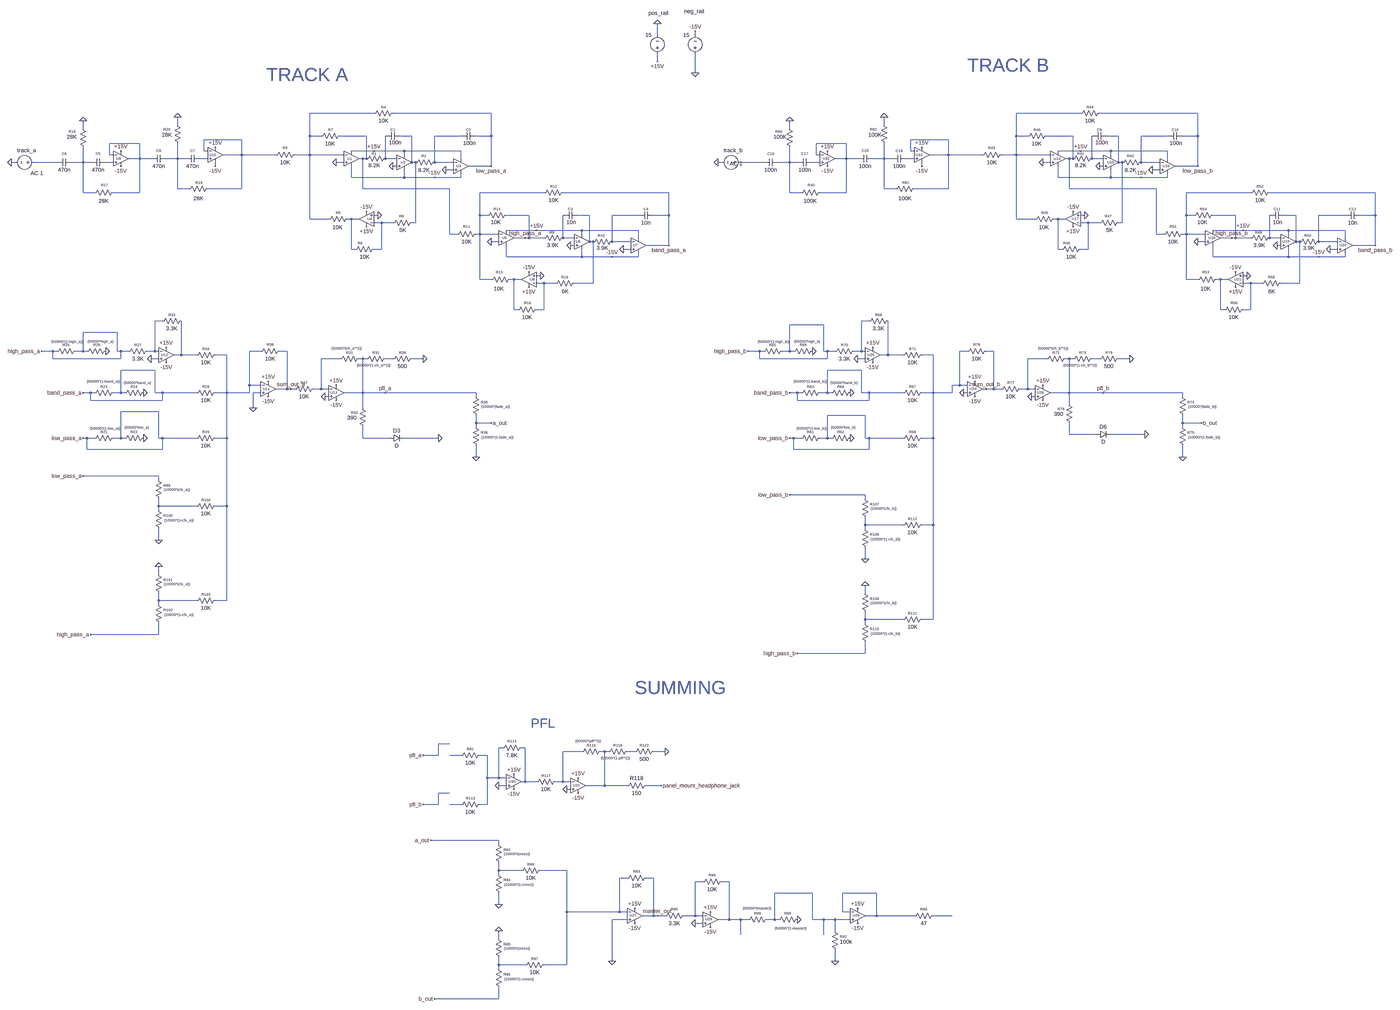
[diagram p0: schematic Full_Mixer.asc, whole sheet]
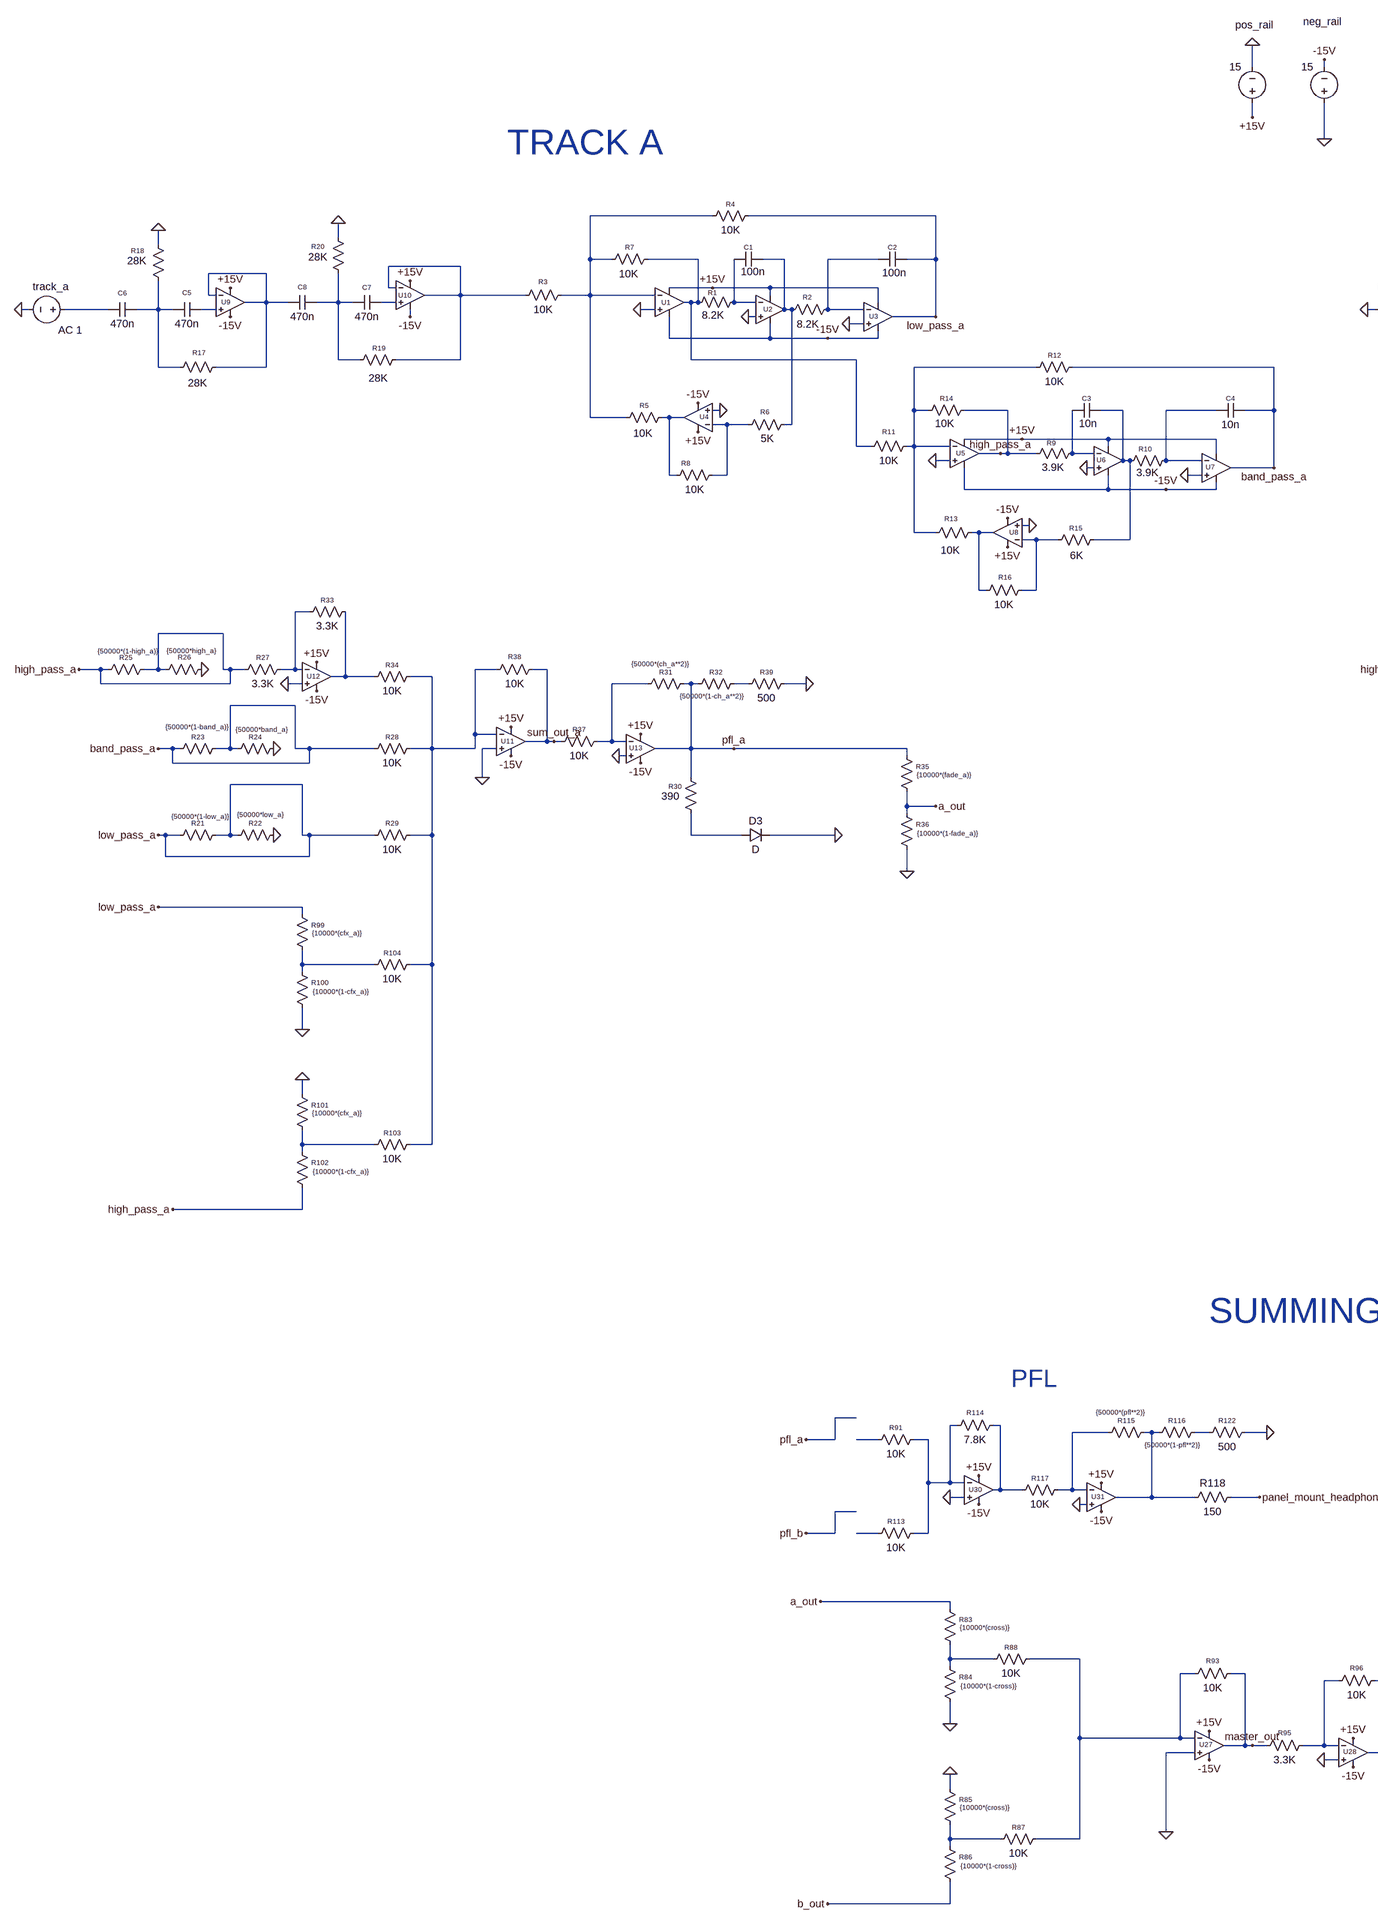
[diagram p1: schematic Full_Mixer.asc, part, row 1 of 1, column 1 of 2]
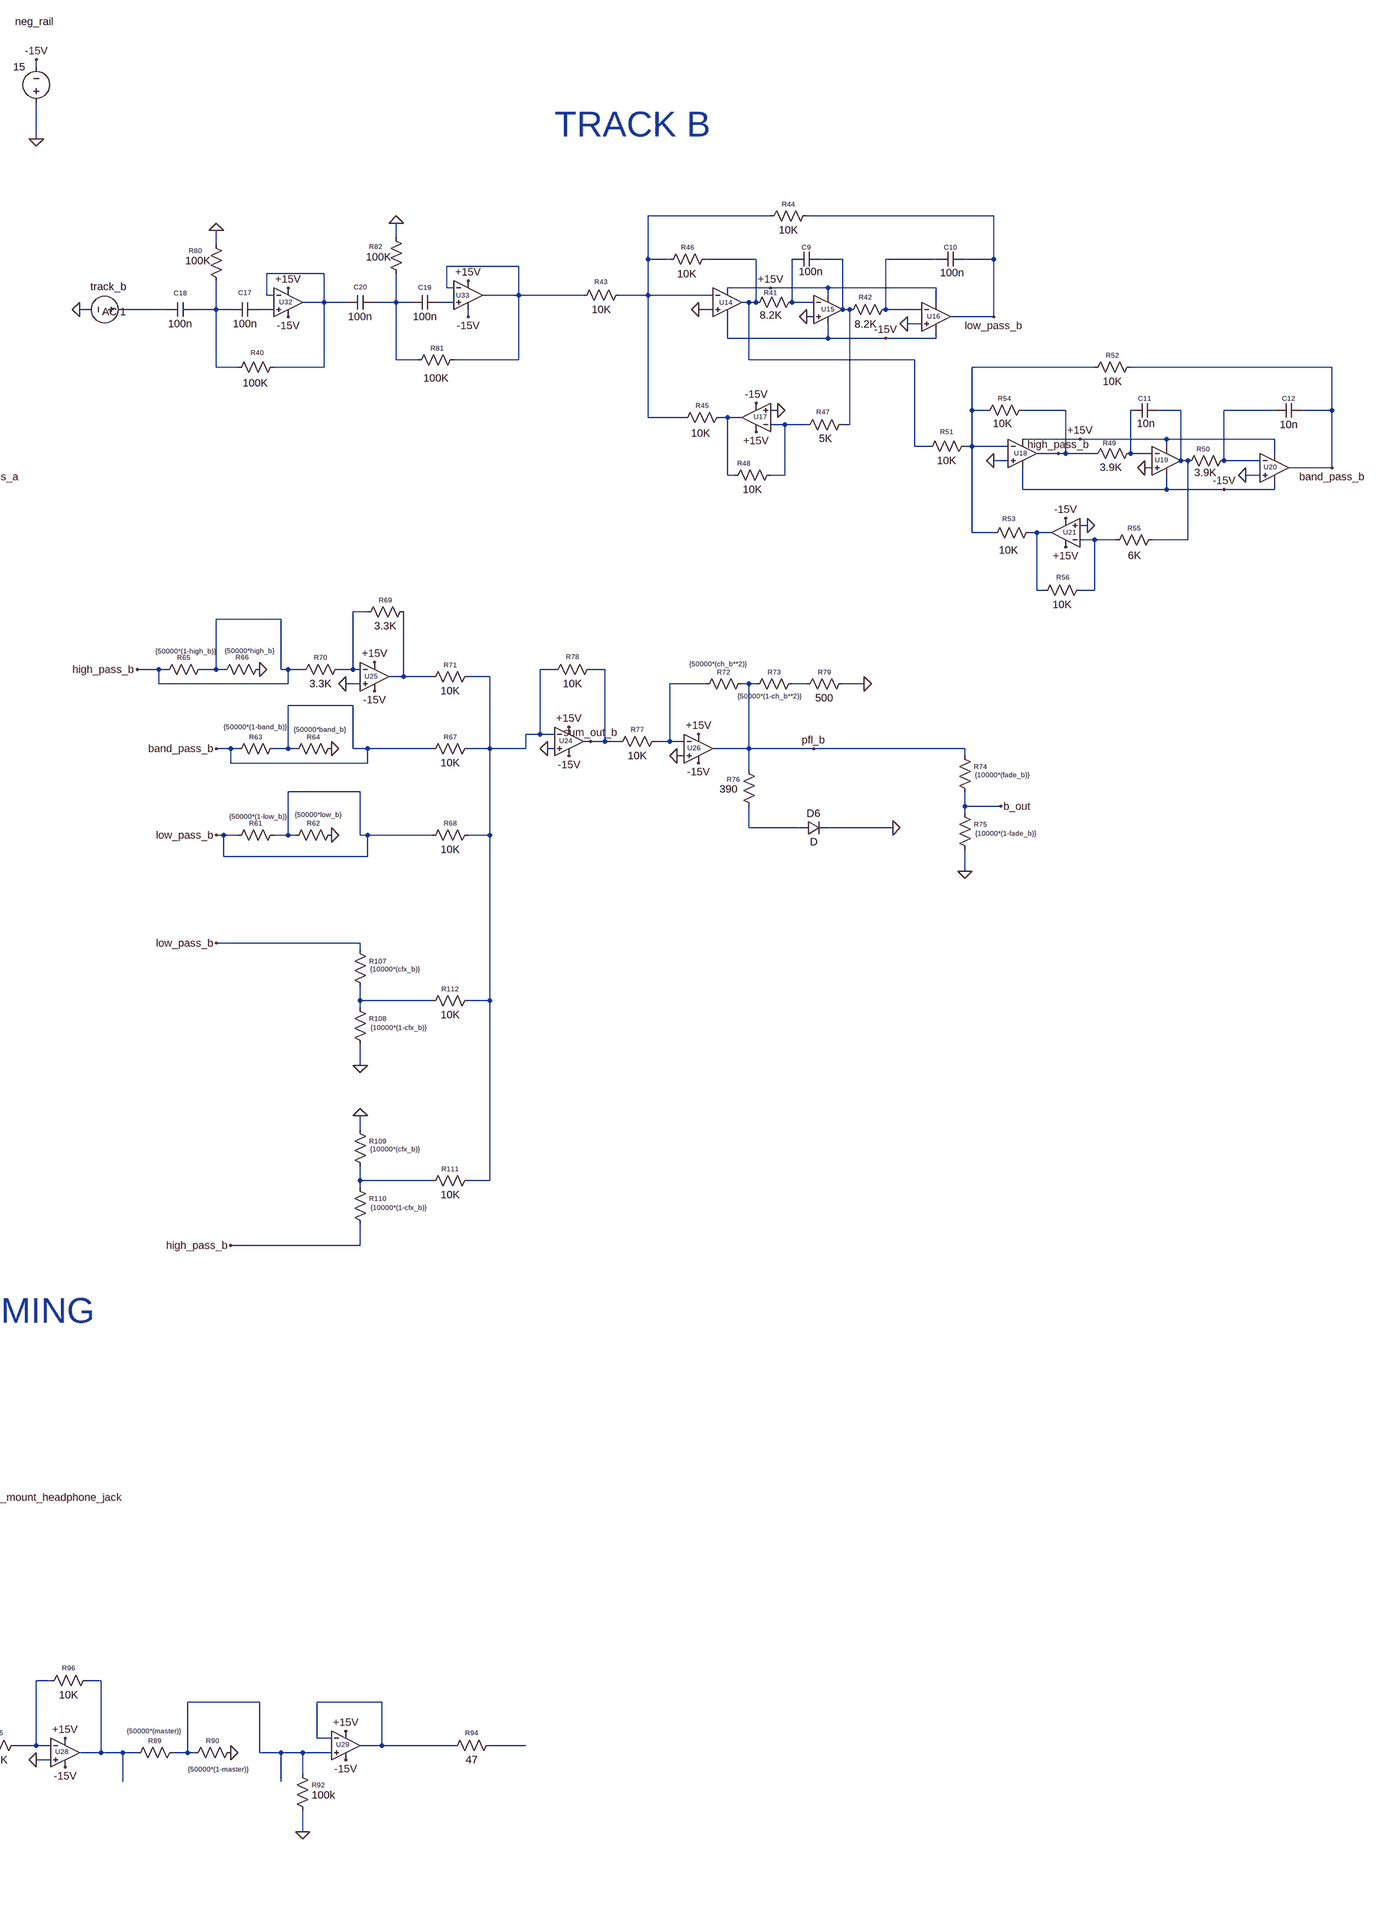
[diagram p2: schematic Full_Mixer.asc, part, row 1 of 1, column 2 of 2]
Full_Mixer.asc, the LTspice schematic file:
Version 4.1
SHEET 1 3956 3308
WIRE 400 -1248 400 -1296
WIRE 560 -1248 560 -1264
WIRE 400 -1136 400 -1168
WIRE 560 -1088 560 -1168
WIRE -800 -880 -1072 -880
WIRE -304 -880 -720 -880
WIRE 2192 -880 1920 -880
WIRE 2688 -880 2272 -880
WIRE -1632 -832 -1632 -864
WIRE 1360 -832 1360 -864
WIRE -2032 -816 -2032 -848
WIRE 960 -816 960 -848
WIRE -1072 -784 -1072 -880
WIRE -1024 -784 -1072 -784
WIRE -832 -784 -944 -784
WIRE -640 -784 -688 -784
WIRE -432 -784 -544 -784
WIRE -304 -784 -304 -880
WIRE -304 -784 -368 -784
WIRE 1920 -784 1920 -880
WIRE 1968 -784 1920 -784
WIRE 2160 -784 2048 -784
WIRE 2352 -784 2304 -784
WIRE 2560 -784 2448 -784
WIRE 2688 -784 2688 -880
WIRE 2688 -784 2624 -784
WIRE -1360 -768 -1520 -768
WIRE 1632 -768 1472 -768
WIRE -1792 -752 -1920 -752
WIRE 1200 -752 1072 -752
WIRE -1520 -720 -1520 -768
WIRE -1504 -720 -1520 -720
WIRE -800 -720 -896 -720
WIRE -672 -720 -800 -720
WIRE -432 -720 -672 -720
WIRE 1472 -720 1472 -768
WIRE 1488 -720 1472 -720
WIRE 2192 -720 2096 -720
WIRE 2320 -720 2192 -720
WIRE 2560 -720 2320 -720
WIRE -1920 -704 -1920 -752
WIRE -1904 -704 -1920 -704
WIRE -1360 -704 -1360 -768
WIRE -1360 -704 -1440 -704
WIRE -1216 -704 -1360 -704
WIRE -1072 -704 -1072 -784
WIRE -1072 -704 -1136 -704
WIRE -928 -704 -1072 -704
WIRE -672 -704 -672 -720
WIRE 1072 -704 1072 -752
WIRE 1088 -704 1072 -704
WIRE 1632 -704 1632 -768
WIRE 1632 -704 1552 -704
WIRE 1776 -704 1632 -704
WIRE 1920 -704 1920 -784
WIRE 1920 -704 1856 -704
WIRE 2064 -704 1920 -704
WIRE 2320 -704 2320 -720
WIRE -1792 -688 -1792 -752
WIRE -1792 -688 -1840 -688
WIRE -1744 -688 -1792 -688
WIRE -1632 -688 -1632 -752
WIRE -1632 -688 -1680 -688
WIRE -1600 -688 -1632 -688
WIRE -1504 -688 -1536 -688
WIRE -848 -688 -864 -688
WIRE -832 -688 -832 -784
WIRE -832 -688 -848 -688
WIRE -752 -688 -752 -784
WIRE -704 -688 -752 -688
WIRE -432 -688 -432 -720
WIRE 1200 -688 1200 -752
WIRE 1200 -688 1152 -688
WIRE 1248 -688 1200 -688
WIRE 1360 -688 1360 -752
WIRE 1360 -688 1312 -688
WIRE 1392 -688 1360 -688
WIRE 1488 -688 1456 -688
WIRE 2144 -688 2128 -688
WIRE 2160 -688 2160 -784
WIRE 2160 -688 2144 -688
WIRE 2240 -688 2240 -784
WIRE 2288 -688 2240 -688
WIRE 2560 -688 2560 -720
WIRE -2320 -672 -2336 -672
WIRE -2144 -672 -2240 -672
WIRE -2032 -672 -2032 -736
WIRE -2032 -672 -2080 -672
WIRE -2000 -672 -2032 -672
WIRE -1904 -672 -1936 -672
WIRE -928 -672 -960 -672
WIRE -640 -672 -640 -784
WIRE -624 -672 -640 -672
WIRE -544 -672 -544 -784
WIRE -464 -672 -544 -672
WIRE 672 -672 656 -672
WIRE 848 -672 752 -672
WIRE 960 -672 960 -736
WIRE 960 -672 912 -672
WIRE 992 -672 960 -672
WIRE 1088 -672 1056 -672
WIRE 2064 -672 2032 -672
WIRE 2352 -672 2352 -784
WIRE 2368 -672 2352 -672
WIRE 2448 -672 2448 -784
WIRE 2528 -672 2448 -672
WIRE -1472 -656 -1472 -672
WIRE -704 -656 -720 -656
WIRE -304 -656 -304 -784
WIRE -304 -656 -400 -656
WIRE 1520 -656 1520 -672
WIRE 2288 -656 2272 -656
WIRE 2688 -656 2688 -784
WIRE 2688 -656 2592 -656
WIRE -464 -640 -496 -640
WIRE 2528 -640 2496 -640
WIRE -896 -608 -896 -656
WIRE -672 -608 -672 -640
WIRE -672 -608 -896 -608
WIRE -544 -608 -672 -608
WIRE -432 -608 -432 -624
WIRE -432 -608 -544 -608
WIRE 2096 -608 2096 -656
WIRE 2320 -608 2320 -640
WIRE 2320 -608 2096 -608
WIRE 2448 -608 2320 -608
WIRE 2560 -608 2560 -624
WIRE 2560 -608 2448 -608
WIRE -1632 -560 -1632 -688
WIRE -1584 -560 -1632 -560
WIRE -1360 -560 -1360 -704
WIRE -1360 -560 -1504 -560
WIRE -848 -560 -848 -688
WIRE -480 -560 -848 -560
WIRE 1360 -560 1360 -688
WIRE 1408 -560 1360 -560
WIRE 1632 -560 1632 -704
WIRE 1632 -560 1488 -560
WIRE 2144 -560 2144 -688
WIRE 2512 -560 2144 -560
WIRE -2032 -544 -2032 -672
WIRE -1984 -544 -2032 -544
WIRE -1792 -544 -1792 -688
WIRE -1792 -544 -1904 -544
WIRE -80 -544 -352 -544
WIRE 448 -544 0 -544
WIRE 960 -544 960 -672
WIRE 1008 -544 960 -544
WIRE 1200 -544 1200 -688
WIRE 1200 -544 1088 -544
WIRE 2912 -544 2640 -544
WIRE 3440 -544 2992 -544
WIRE -784 -448 -800 -448
WIRE -352 -448 -352 -544
WIRE -320 -448 -352 -448
WIRE -144 -448 -240 -448
WIRE 112 -448 64 -448
WIRE 320 -448 208 -448
WIRE 448 -448 448 -544
WIRE 448 -448 384 -448
WIRE 2208 -448 2192 -448
WIRE 2640 -448 2640 -544
WIRE 2672 -448 2640 -448
WIRE 2848 -448 2752 -448
WIRE 3104 -448 3056 -448
WIRE 3312 -448 3200 -448
WIRE 3440 -448 3440 -544
WIRE 3440 -448 3376 -448
WIRE -1072 -432 -1072 -704
WIRE -992 -432 -1072 -432
WIRE -896 -432 -912 -432
WIRE -864 -432 -896 -432
WIRE 1920 -432 1920 -704
WIRE 2000 -432 1920 -432
WIRE 2096 -432 2080 -432
WIRE 2128 -432 2096 -432
WIRE -768 -416 -800 -416
WIRE -720 -416 -768 -416
WIRE -624 -416 -624 -672
WIRE -624 -416 -640 -416
WIRE 2224 -416 2192 -416
WIRE 2272 -416 2224 -416
WIRE 2368 -416 2368 -672
WIRE 2368 -416 2352 -416
WIRE -112 -384 -240 -384
WIRE 80 -384 -112 -384
WIRE 320 -384 80 -384
WIRE 2880 -384 2752 -384
WIRE 3072 -384 2880 -384
WIRE 3312 -384 3072 -384
WIRE -480 -368 -480 -560
WIRE -448 -368 -480 -368
WIRE -352 -368 -352 -448
WIRE -352 -368 -368 -368
WIRE -272 -368 -352 -368
WIRE 80 -368 80 -384
WIRE 2512 -368 2512 -560
WIRE 2544 -368 2512 -368
WIRE 2640 -368 2640 -448
WIRE 2640 -368 2624 -368
WIRE 2720 -368 2640 -368
WIRE 3072 -368 3072 -384
WIRE -160 -352 -208 -352
WIRE -144 -352 -144 -448
WIRE -144 -352 -160 -352
WIRE -80 -352 -144 -352
WIRE 0 -352 0 -448
WIRE 48 -352 0 -352
WIRE 320 -352 320 -384
WIRE 2832 -352 2784 -352
WIRE 2848 -352 2848 -448
WIRE 2848 -352 2832 -352
WIRE 2912 -352 2848 -352
WIRE 2992 -352 2992 -448
WIRE 3040 -352 2992 -352
WIRE 3312 -352 3312 -384
WIRE -272 -336 -304 -336
WIRE 112 -336 112 -448
WIRE 128 -336 112 -336
WIRE 208 -336 208 -448
WIRE 288 -336 208 -336
WIRE 2720 -336 2688 -336
WIRE 3104 -336 3104 -448
WIRE 3120 -336 3104 -336
WIRE 3200 -336 3200 -448
WIRE 3280 -336 3200 -336
WIRE 48 -320 32 -320
WIRE 448 -320 448 -448
WIRE 448 -320 352 -320
WIRE 3040 -320 3024 -320
WIRE 3440 -320 3440 -448
WIRE 3440 -320 3344 -320
WIRE -896 -304 -896 -432
WIRE -880 -304 -896 -304
WIRE -768 -304 -768 -416
WIRE -768 -304 -800 -304
WIRE 288 -304 256 -304
WIRE 2096 -304 2096 -432
WIRE 2112 -304 2096 -304
WIRE 2224 -304 2224 -416
WIRE 2224 -304 2192 -304
WIRE 3280 -304 3248 -304
WIRE -240 -272 -240 -320
WIRE 80 -272 80 -304
WIRE 80 -272 -240 -272
WIRE 208 -272 80 -272
WIRE 320 -272 320 -288
WIRE 320 -272 208 -272
WIRE 2752 -272 2752 -320
WIRE 3072 -272 3072 -304
WIRE 3072 -272 2752 -272
WIRE 3200 -272 3072 -272
WIRE 3312 -272 3312 -288
WIRE 3312 -272 3200 -272
WIRE -96 -192 -112 -192
WIRE 2896 -192 2880 -192
WIRE -352 -176 -352 -368
WIRE -304 -176 -352 -176
WIRE -208 -176 -224 -176
WIRE -176 -176 -208 -176
WIRE 2640 -176 2640 -368
WIRE 2688 -176 2640 -176
WIRE 2784 -176 2768 -176
WIRE 2816 -176 2784 -176
WIRE -80 -160 -112 -160
WIRE -32 -160 -80 -160
WIRE 128 -160 128 -336
WIRE 128 -160 48 -160
WIRE 2912 -160 2880 -160
WIRE 2960 -160 2912 -160
WIRE 3120 -160 3120 -336
WIRE 3120 -160 3040 -160
WIRE -208 -48 -208 -176
WIRE -192 -48 -208 -48
WIRE -80 -48 -80 -160
WIRE -80 -48 -112 -48
WIRE 2784 -48 2784 -176
WIRE 2800 -48 2784 -48
WIRE 2912 -48 2912 -160
WIRE 2912 -48 2880 -48
WIRE -1696 0 -1728 0
WIRE 1296 0 1264 0
WIRE 1104 16 960 16
WIRE -1888 48 -2032 48
WIRE -2160 128 -2208 128
WIRE -2144 128 -2160 128
WIRE -2032 128 -2032 48
WIRE -2032 128 -2064 128
WIRE -2016 128 -2032 128
WIRE -1888 128 -1888 48
WIRE -1872 128 -1888 128
WIRE -1840 128 -1872 128
WIRE -1728 128 -1728 0
WIRE -1728 128 -1760 128
WIRE -1712 128 -1728 128
WIRE -1280 128 -1328 128
WIRE -1168 128 -1200 128
WIRE 832 128 784 128
WIRE 848 128 832 128
WIRE 960 128 960 16
WIRE 960 128 928 128
WIRE 976 128 960 128
WIRE 1104 128 1104 16
WIRE 1120 128 1104 128
WIRE 1152 128 1120 128
WIRE 1264 128 1264 0
WIRE 1264 128 1232 128
WIRE 1280 128 1264 128
WIRE 1712 128 1680 128
WIRE 1824 128 1792 128
WIRE -1616 144 -1616 0
WIRE -1616 144 -1648 144
WIRE -1552 144 -1616 144
WIRE -1424 144 -1472 144
WIRE 1376 144 1376 0
WIRE 1376 144 1344 144
WIRE 1440 144 1376 144
WIRE 1568 144 1520 144
WIRE -2160 160 -2160 128
WIRE -1872 160 -1872 128
WIRE -1872 160 -2160 160
WIRE -1712 160 -1744 160
WIRE -944 160 -1024 160
WIRE -848 160 -864 160
WIRE -832 160 -848 160
WIRE -720 160 -752 160
WIRE -592 160 -640 160
WIRE 832 160 832 128
WIRE 1120 160 1120 128
WIRE 1120 160 832 160
WIRE 1280 160 1248 160
WIRE 2048 160 1968 160
WIRE 2144 160 2128 160
WIRE 2160 160 2144 160
WIRE 2272 160 2240 160
WIRE 2400 160 2352 160
WIRE -1728 208 -1872 208
WIRE 1264 208 1120 208
WIRE -1328 272 -1328 128
WIRE -1280 272 -1328 272
WIRE 1680 272 1680 128
WIRE 1680 272 1648 272
WIRE 1712 272 1680 272
WIRE -1168 288 -1168 128
WIRE -1168 288 -1216 288
WIRE -1152 288 -1168 288
WIRE -1136 288 -1152 288
WIRE -1024 288 -1024 160
WIRE -1024 288 -1056 288
WIRE -992 288 -1024 288
WIRE 1792 288 1776 288
WIRE 1824 288 1824 128
WIRE 1824 288 1792 288
WIRE 1856 288 1824 288
WIRE 1968 288 1968 160
WIRE 1968 288 1936 288
WIRE 2000 288 1968 288
WIRE -2000 304 -2032 304
WIRE -1984 304 -2000 304
WIRE -1872 304 -1872 208
WIRE -1872 304 -1904 304
WIRE -1856 304 -1872 304
WIRE -1728 304 -1728 208
WIRE -1696 304 -1728 304
WIRE -1552 304 -1696 304
WIRE -1424 304 -1424 144
WIRE -1424 304 -1472 304
WIRE -1328 304 -1328 272
WIRE -1328 304 -1424 304
WIRE -1280 304 -1312 304
WIRE -848 304 -848 160
WIRE -848 304 -928 304
WIRE -752 304 -848 304
WIRE -368 304 -752 304
WIRE 992 304 960 304
WIRE 1008 304 992 304
WIRE 1120 304 1120 208
WIRE 1120 304 1088 304
WIRE 1136 304 1120 304
WIRE 1264 304 1264 208
WIRE 1296 304 1264 304
WIRE 1440 304 1296 304
WIRE 1568 304 1568 144
WIRE 1568 304 1520 304
WIRE 1648 304 1648 272
WIRE 1648 304 1568 304
WIRE 1712 304 1696 304
WIRE 2144 304 2144 160
WIRE 2144 304 2064 304
WIRE 2288 304 2144 304
WIRE 2624 304 2288 304
WIRE -992 320 -1008 320
WIRE -368 320 -368 304
WIRE 2000 320 1984 320
WIRE 2624 320 2624 304
WIRE -2000 336 -2000 304
WIRE -1696 336 -1696 304
WIRE -1696 336 -2000 336
WIRE 992 336 992 304
WIRE 1296 336 1296 304
WIRE 1296 336 992 336
WIRE 2144 352 2144 304
WIRE -1312 368 -1312 304
WIRE -848 368 -848 304
WIRE -1712 384 -1872 384
WIRE 1280 400 1120 400
WIRE -368 432 -368 400
WIRE -304 432 -368 432
WIRE 2624 432 2624 400
WIRE 2704 432 2624 432
WIRE -368 448 -368 432
WIRE 2624 448 2624 432
WIRE 2144 480 2144 432
WIRE 2256 480 2144 480
WIRE 2464 480 2320 480
WIRE -2016 496 -2032 496
WIRE -1984 496 -2016 496
WIRE -1872 496 -1872 384
WIRE -1872 496 -1904 496
WIRE -1856 496 -1872 496
WIRE -1712 496 -1712 384
WIRE -1696 496 -1712 496
WIRE -1552 496 -1696 496
WIRE -1424 496 -1424 304
WIRE -1424 496 -1472 496
WIRE -848 496 -848 448
WIRE -736 496 -848 496
WIRE -528 496 -672 496
WIRE 976 496 960 496
WIRE 1008 496 976 496
WIRE 1120 496 1120 400
WIRE 1120 496 1088 496
WIRE 1136 496 1120 496
WIRE 1280 496 1280 400
WIRE 1296 496 1280 496
WIRE 1440 496 1296 496
WIRE 1568 496 1568 304
WIRE 1568 496 1520 496
WIRE -2016 544 -2016 496
WIRE -1696 544 -1696 496
WIRE -1696 544 -2016 544
WIRE 976 544 976 496
WIRE 1296 544 1296 496
WIRE 1296 544 976 544
WIRE -368 576 -368 528
WIRE 2624 576 2624 528
WIRE -1712 656 -2032 656
WIRE -1712 672 -1712 656
WIRE 1280 736 960 736
WIRE 1280 752 1280 736
WIRE -1712 784 -1712 752
WIRE -1552 784 -1712 784
WIRE -1424 784 -1424 496
WIRE -1424 784 -1472 784
WIRE -1712 800 -1712 784
WIRE 1280 864 1280 832
WIRE 1440 864 1280 864
WIRE 1568 864 1568 496
WIRE 1568 864 1520 864
WIRE 1280 880 1280 864
WIRE -1712 928 -1712 880
WIRE 1280 1008 1280 960
WIRE -1712 1072 -1712 1040
WIRE 1280 1152 1280 1120
WIRE -1712 1184 -1712 1152
WIRE -1552 1184 -1712 1184
WIRE -1424 1184 -1424 784
WIRE -1424 1184 -1472 1184
WIRE -1712 1200 -1712 1184
WIRE 1280 1264 1280 1232
WIRE 1440 1264 1280 1264
WIRE 1568 1264 1568 864
WIRE 1568 1264 1520 1264
WIRE 1280 1280 1280 1264
WIRE -1712 1328 -1712 1280
WIRE -1712 1328 -2000 1328
WIRE 1280 1408 1280 1360
WIRE 1280 1408 992 1408
WIRE -480 2080 -528 2080
WIRE -256 2096 -272 2096
WIRE -160 2096 -176 2096
WIRE 80 2112 0 2112
WIRE 176 2112 160 2112
WIRE 192 2112 176 2112
WIRE 304 2112 272 2112
WIRE 432 2112 384 2112
WIRE -528 2128 -528 2080
WIRE -528 2128 -592 2128
WIRE -432 2128 -480 2128
WIRE -320 2128 -352 2128
WIRE -320 2224 -320 2128
WIRE -272 2224 -272 2096
WIRE -272 2224 -320 2224
WIRE -240 2224 -272 2224
WIRE -160 2240 -160 2096
WIRE -160 2240 -176 2240
WIRE -112 2240 -160 2240
WIRE 0 2240 0 2112
WIRE 0 2240 -32 2240
WIRE 32 2240 0 2240
WIRE -240 2256 -272 2256
WIRE 176 2256 176 2112
WIRE 176 2256 96 2256
WIRE 272 2256 176 2256
WIRE 416 2256 352 2256
WIRE 32 2272 16 2272
WIRE -480 2288 -528 2288
WIRE -528 2336 -528 2288
WIRE -528 2336 -592 2336
WIRE -432 2336 -480 2336
WIRE -320 2336 -320 2224
WIRE -320 2336 -352 2336
WIRE -272 2576 -560 2576
WIRE -272 2592 -272 2576
WIRE -272 2704 -272 2672
WIRE -176 2704 -272 2704
WIRE 16 2704 -96 2704
WIRE -272 2720 -272 2704
WIRE 272 2736 240 2736
WIRE 384 2736 352 2736
WIRE 592 2752 560 2752
WIRE 704 2752 672 2752
WIRE 1056 2800 896 2800
WIRE 1328 2800 1184 2800
WIRE -272 2848 -272 2800
WIRE 16 2880 16 2704
WIRE 240 2880 240 2736
WIRE 240 2880 16 2880
WIRE 272 2880 240 2880
WIRE 1184 2880 1184 2800
WIRE 1216 2880 1184 2880
WIRE 384 2896 384 2736
WIRE 384 2896 336 2896
WIRE 400 2896 384 2896
WIRE 432 2896 400 2896
WIRE 560 2896 560 2752
WIRE 560 2896 512 2896
WIRE 592 2896 560 2896
WIRE 1328 2896 1328 2800
WIRE 1328 2896 1280 2896
WIRE 1488 2896 1328 2896
WIRE 1648 2896 1568 2896
WIRE 272 2912 208 2912
WIRE 704 2912 704 2752
WIRE 704 2912 656 2912
WIRE 752 2912 704 2912
WIRE 784 2912 752 2912
WIRE 896 2912 896 2800
WIRE 896 2912 864 2912
WIRE 912 2912 896 2912
WIRE 1056 2912 1056 2800
WIRE 1104 2912 1056 2912
WIRE 1152 2912 1104 2912
WIRE 1216 2912 1152 2912
WIRE 592 2928 560 2928
WIRE 1152 2960 1152 2912
WIRE 752 2976 752 2912
WIRE 1104 2976 1104 2912
WIRE -272 2992 -272 2960
WIRE 208 3088 208 2912
WIRE 1152 3088 1152 3040
WIRE -272 3104 -272 3072
WIRE -160 3104 -272 3104
WIRE 16 3104 16 2880
WIRE 16 3104 -80 3104
WIRE -272 3120 -272 3104
WIRE -272 3248 -272 3200
WIRE -272 3248 -544 3248
FLAG 400 -1296 0
FLAG -720 -656 0
FLAG -496 -640 0
FLAG -960 -672 0
FLAG -2336 -672 0
FLAG 560 -1088 0
FLAG -784 -448 0
FLAG -800 -720 +15V
FLAG 400 -1136 +15V
FLAG -832 -400 +15V
FLAG -544 -608 -15V
FLAG 560 -1264 -15V
FLAG -832 -464 -15V
FLAG 32 -320 0
FLAG 256 -304 0
FLAG -304 -336 0
FLAG -96 -192 0
FLAG -112 -384 +15V
FLAG -144 -144 +15V
FLAG 208 -272 -15V
FLAG -144 -208 -15V
FLAG -2032 -848 0
FLAG -1872 -656 -15V
FLAG -1872 -720 +15V
FLAG -1632 -864 0
FLAG -1472 -656 -15V
FLAG -1472 -736 +15V
FLAG -304 -656 low_pass_a
FLAG 448 -320 band_pass_a
FLAG -2032 496 low_pass_a
FLAG -2032 304 band_pass_a
FLAG -160 -352 high_pass_a
FLAG -2208 128 high_pass_a
FLAG -1312 368 0
FLAG -1248 320 -15V
FLAG -1248 256 +15V
FLAG -1744 160 0
FLAG -1680 112 +15V
FLAG -1680 176 -15V
FLAG -960 336 -15V
FLAG -960 272 +15V
FLAG -1008 320 0
FLAG -592 160 0
FLAG -368 576 0
FLAG 2272 -656 0
FLAG 2496 -640 0
FLAG 2032 -672 0
FLAG 656 -672 0
FLAG 2208 -448 0
FLAG 2192 -720 +15V
FLAG 2160 -400 +15V
FLAG 2448 -608 -15V
FLAG 2160 -464 -15V
FLAG 3024 -320 0
FLAG 3248 -304 0
FLAG 2688 -336 0
FLAG 2896 -192 0
FLAG 2880 -384 +15V
FLAG 2848 -144 +15V
FLAG 3200 -272 -15V
FLAG 2848 -208 -15V
FLAG 2688 -656 low_pass_b
FLAG 3440 -320 band_pass_b
FLAG 960 496 low_pass_b
FLAG 960 304 band_pass_b
FLAG 2832 -352 high_pass_b
FLAG 784 128 high_pass_b
FLAG 1696 304 0
FLAG 1744 320 -15V
FLAG 1744 256 +15V
FLAG 1248 160 0
FLAG 1312 112 +15V
FLAG 1312 176 -15V
FLAG 2032 336 -15V
FLAG 2032 272 +15V
FLAG 1984 320 0
FLAG 2400 160 0
FLAG 2624 576 0
FLAG -304 432 a_out
FLAG 2704 432 b_out
FLAG -560 2576 a_out
FLAG -544 3248 b_out
FLAG -272 2848 0
FLAG -272 2960 0
FLAG 208 3088 0
FLAG 304 2928 -15V
FLAG 304 2864 +15V
FLAG 624 2880 +15V
FLAG 624 2944 -15V
FLAG 560 2928 0
FLAG -1936 128 0
FLAG -1776 304 0
FLAG -1776 496 0
FLAG 1056 128 0
FLAG 1216 304 0
FLAG 1216 496 0
FLAG 992 2912 0
FLAG 1152 3088 0
FLAG 1248 2928 -15V
FLAG 1248 2864 +15V
FLAG -2032 656 low_pass_a
FLAG -2000 1328 high_pass_a
FLAG -1712 928 0
FLAG -1712 1040 0
FLAG 960 736 low_pass_b
FLAG 992 1408 high_pass_b
FLAG 1280 1008 0
FLAG 1280 1120 0
FLAG 1792 288 sum_out_b
FLAG -1152 288 sum_out_a
FLAG 400 2896 master_out
FLAG -528 496 0
FLAG 2464 480 0
FLAG -752 304 pfl_a
FLAG 2288 304 pfl_b
FLAG -592 2336 pfl_b
FLAG -592 2128 pfl_a
FLAG -272 2256 0
FLAG -208 2272 -15V
FLAG -208 2208 +15V
FLAG 64 2224 +15V
FLAG 16 2272 0
FLAG 432 2112 0
FLAG 416 2256 panel_mount_headphone_jack
FLAG 64 2288 -15V
FLAG 960 -848 0
FLAG 1120 -656 -15V
FLAG 1120 -720 +15V
FLAG 1360 -864 0
FLAG 1520 -656 -15V
FLAG 1520 -736 +15V
SYMBOL OpAmps\\UniversalOpAmp2 -896 -688 R0
WINDOW 0 -18 0 Left 1
SYMATTR InstName U1
SYMATTR Value2 Avol=200K GBW=10Meg Slew=9Meg
SYMATTR SpiceLine Ilimit=30m Rail=0
SYMBOL OpAmps\\UniversalOpAmp2 -672 -672 R0
WINDOW 0 -15 -1 Left 1
SYMATTR InstName U2
SYMATTR Value2 Avol=200K GBW=10Meg Slew=9Meg
SYMATTR SpiceLine Ilimit=30m Rail=0 Vos=0
SYMBOL OpAmps\\UniversalOpAmp2 -432 -656 R0
WINDOW 0 -20 -1 Left 1
SYMATTR InstName U3
SYMATTR Value2 Avol=200K GBW=10Meg Slew=9Meg
SYMATTR SpiceLine Ilimit=30m Rail=0 Vos=0
SYMBOL OpAmps\\UniversalOpAmp2 -832 -432 R180
WINDOW 0 -24 2 Left 1
SYMATTR InstName U4
SYMATTR Value2 Avol=200K GBW=10Meg Slew=9Meg
SYMATTR SpiceLine Ilimit=30m Rail=0 Vos=0
SYMBOL voltage 400 -1152 R180
WINDOW 0 -47 189 Left 2
WINDOW 123 0 0 Left 0
WINDOW 39 0 0 Left 0
SYMATTR InstName pos_rail
SYMATTR Value 15
SYMBOL res -736 -704 R90
WINDOW 0 5 64 VBottom 1
WINDOW 3 29 63 VTop 2
SYMATTR InstName R1
SYMATTR Value 8.2K
SYMATTR SpiceLine tol=1
SYMBOL res -528 -688 R90
WINDOW 0 -1 61 VBottom 1
WINDOW 3 33 60 VTop 2
SYMATTR InstName R2
SYMATTR Value 8.2K
SYMATTR SpiceLine tol=1
SYMBOL res -1120 -720 R90
WINDOW 0 -3 57 VBottom 1
WINDOW 3 32 56 VTop 2
SYMATTR InstName R3
SYMATTR Value 10K
SYMATTR SpiceLine tol=1
SYMBOL res -704 -896 R90
WINDOW 0 0 56 VBottom 1
WINDOW 3 32 56 VTop 2
SYMATTR InstName R4
SYMATTR Value 10K
SYMATTR SpiceLine tol=1
SYMBOL res -896 -448 R90
WINDOW 0 0 56 VBottom 1
WINDOW 3 35 59 VTop 2
SYMATTR InstName R5
SYMATTR Value 10K
SYMATTR SpiceLine tol=1
SYMBOL res -928 -800 R90
WINDOW 0 0 56 VBottom 1
WINDOW 3 33 58 VTop 2
SYMATTR InstName R7
SYMATTR Value 10K
SYMATTR SpiceLine tol=1
SYMBOL cap -688 -800 R90
WINDOW 0 0 32 VBottom 1
WINDOW 3 28 22 VTop 2
SYMATTR InstName C1
SYMATTR Value 100n
SYMBOL cap -368 -800 R90
WINDOW 0 0 32 VBottom 1
WINDOW 3 31 28 VTop 2
SYMATTR InstName C2
SYMATTR Value 100n
SYMBOL res -624 -432 R90
WINDOW 0 -2 59 VBottom 1
WINDOW 3 31 54 VTop 2
SYMATTR InstName R6
SYMATTR Value 5K
SYMATTR SpiceLine tol=1
SYMBOL res -784 -320 R90
WINDOW 0 0 75 VBottom 1
WINDOW 3 32 56 VTop 2
SYMATTR InstName R8
SYMATTR Value 10K
SYMATTR SpiceLine tol=1
SYMBOL voltage -2224 -672 R90
WINDOW 0 -51 8 VRight 2
WINDOW 3 -23 8 VRight 2
WINDOW 123 46 -23 VRight 2
WINDOW 39 0 0 Left 0
SYMATTR InstName track_a
SYMATTR Value ""
SYMATTR Value2 AC 1
SYMBOL voltage 560 -1152 R180
WINDOW 0 -39 197 Left 2
WINDOW 123 0 0 Left 0
WINDOW 39 0 0 Left 0
SYMATTR InstName neg_rail
SYMATTR Value 15
SYMBOL OpAmps\\UniversalOpAmp2 -240 -352 R0
WINDOW 0 -19 -1 Left 1
SYMATTR InstName U5
SYMATTR Value2 Avol=200K GBW=10Meg Slew=9Meg
SYMATTR SpiceLine Ilimit=30m Rail=0
SYMBOL OpAmps\\UniversalOpAmp2 80 -336 R0
WINDOW 0 -26 -2 Left 1
SYMATTR InstName U6
SYMATTR Value2 Avol=200K GBW=10Meg Slew=9Meg
SYMATTR SpiceLine Ilimit=30m Rail=0 Vos=0
SYMBOL OpAmps\\UniversalOpAmp2 320 -320 R0
WINDOW 0 -24 -2 Left 1
SYMATTR InstName U7
SYMATTR Value2 Avol=200K GBW=10Meg Slew=9Meg
SYMATTR SpiceLine Ilimit=30m Rail=0 Vos=0
SYMBOL OpAmps\\UniversalOpAmp2 -144 -176 R180
WINDOW 0 -24 1 Left 1
SYMATTR InstName U8
SYMATTR Value2 Avol=200K GBW=10Meg Slew=9Meg
SYMATTR SpiceLine Ilimit=30m Rail=0 Vos=0
SYMBOL res 16 -368 R90
WINDOW 0 3 63 VBottom 1
WINDOW 3 31 59 VTop 2
SYMATTR InstName R9
SYMATTR Value 3.9K
SYMATTR SpiceLine tol=1
SYMBOL res 224 -352 R90
WINDOW 0 0 62 VBottom 1
WINDOW 3 27 57 VTop 2
SYMATTR InstName R10
SYMATTR Value 3.9K
SYMATTR SpiceLine tol=1
SYMBOL res -352 -384 R90
WINDOW 0 -6 56 VBottom 1
WINDOW 3 32 56 VTop 2
SYMATTR InstName R11
SYMATTR Value 10K
SYMATTR SpiceLine tol=1
SYMBOL res 16 -560 R90
WINDOW 0 0 56 VBottom 1
WINDOW 3 32 56 VTop 2
SYMATTR InstName R12
SYMATTR Value 10K
SYMATTR SpiceLine tol=1
SYMBOL res -208 -192 R90
WINDOW 0 -5 62 VBottom 1
WINDOW 3 39 63 VTop 2
SYMATTR InstName R13
SYMATTR Value 10K
SYMATTR SpiceLine tol=1
SYMBOL res -224 -464 R90
WINDOW 0 0 56 VBottom 1
WINDOW 3 30 60 VTop 2
SYMATTR InstName R14
SYMATTR Value 10K
SYMATTR SpiceLine tol=1
SYMBOL cap 64 -464 R90
WINDOW 0 0 32 VBottom 1
WINDOW 3 30 29 VTop 2
SYMATTR InstName C3
SYMATTR Value 10n
SYMBOL cap 384 -464 R90
WINDOW 0 0 32 VBottom 1
WINDOW 3 32 32 VTop 2
SYMATTR InstName C4
SYMATTR Value 10n
SYMBOL res 64 -176 R90
WINDOW 0 0 56 VBottom 1
WINDOW 3 35 55 VTop 2
SYMATTR InstName R15
SYMATTR Value 6K
SYMATTR SpiceLine tol=1
SYMBOL res -96 -64 R90
WINDOW 0 -3 54 VBottom 1
WINDOW 3 32 56 VTop 2
SYMATTR InstName R16
SYMATTR Value 10K
SYMATTR SpiceLine tol=1
SYMBOL OpAmps\\UniversalOpAmp2 -1872 -688 R0
WINDOW 0 -20 -1 Left 1
SYMATTR InstName U9
SYMATTR Value2 Avol=200K GBW=10Meg Slew=9Meg
SYMATTR SpiceLine Ilimit=30m Rail=0
SYMBOL res -1888 -560 R90
WINDOW 0 -6 53 VBottom 1
WINDOW 3 36 57 VTop 2
SYMATTR InstName R17
SYMATTR Value 28K
SYMATTR SpiceLine tol=1
SYMBOL res -2048 -832 R0
WINDOW 0 -45 29 Left 1
WINDOW 3 -53 52 Left 2
SYMATTR InstName R18
SYMATTR Value 28K
SYMATTR SpiceLine tol=1
SYMBOL cap -1936 -688 R90
WINDOW 0 -11 32 VBottom 1
WINDOW 3 32 32 VTop 2
SYMATTR InstName C5
SYMATTR Value 470n
SYMBOL cap -2080 -688 R90
WINDOW 0 -10 32 VBottom 1
WINDOW 3 32 32 VTop 2
SYMATTR InstName C6
SYMATTR Value 470n
SYMBOL OpAmps\\UniversalOpAmp2 -1472 -704 R0
WINDOW 0 -27 0 Left 1
SYMATTR InstName U10
SYMATTR Value2 Avol=200K GBW=10Meg Slew=9Meg
SYMATTR SpiceLine Ilimit=30m Rail=0
SYMBOL res -1488 -576 R90
WINDOW 0 0 53 VBottom 1
WINDOW 3 41 55 VTop 2
SYMATTR InstName R19
SYMATTR Value 28K
SYMATTR SpiceLine tol=1
SYMBOL res -1648 -848 R0
WINDOW 0 -44 36 Left 1
WINDOW 3 -51 59 Left 2
SYMATTR InstName R20
SYMATTR Value 28K
SYMATTR SpiceLine tol=1
SYMBOL cap -1536 -704 R90
WINDOW 0 -7 32 VBottom 1
WINDOW 3 32 32 VTop 2
SYMATTR InstName C7
SYMATTR Value 470n
SYMBOL cap -1680 -704 R90
WINDOW 0 -8 32 VBottom 1
WINDOW 3 32 32 VTop 2
SYMATTR InstName C8
SYMATTR Value 470n
SYMBOL res -2000 512 R270
WINDOW 0 32 56 VTop 1
WINDOW 3 68 62 VBottom 1
SYMATTR InstName R21
SYMATTR Value {50000*(1-low_a)}
SYMATTR SpiceLine tol=1
SYMBOL res -1872 512 R270
WINDOW 0 32 56 VTop 1
WINDOW 3 72 67 VBottom 1
SYMATTR InstName R22
SYMATTR Value {50000*low_a}
SYMATTR SpiceLine tol=1
SYMBOL res -2000 320 R270
WINDOW 0 32 56 VTop 1
WINDOW 3 75 55 VBottom 1
SYMATTR InstName R23
SYMATTR Value {50000*(1-band_a)}
SYMATTR SpiceLine tol=1
SYMBOL res -1872 320 R270
WINDOW 0 32 56 VTop 1
WINDOW 3 69 70 VBottom 1
SYMATTR InstName R24
SYMATTR Value {50000*band_a}
SYMATTR SpiceLine tol=1
SYMBOL res -2160 144 R270
WINDOW 0 32 56 VTop 1
WINDOW 3 67 61 VBottom 1
SYMATTR InstName R25
SYMATTR Value {50000*(1-high_a)}
SYMATTR SpiceLine tol=1
SYMBOL res -2032 144 R270
WINDOW 0 33 58 VTop 1
WINDOW 3 68 74 VBottom 1
SYMATTR InstName R26
SYMATTR Value {50000*high_a}
SYMATTR SpiceLine tol=1
SYMBOL res -1456 288 R90
WINDOW 0 0 56 VBottom 1
WINDOW 3 32 56 VTop 2
SYMATTR InstName R28
SYMATTR Value 10K
SYMATTR SpiceLine tol=1
SYMBOL res -1456 480 R90
WINDOW 0 0 56 VBottom 1
WINDOW 3 32 56 VTop 2
SYMATTR InstName R29
SYMATTR Value 10K
SYMATTR SpiceLine tol=1
SYMBOL OpAmps\\UniversalOpAmp2 -1248 288 R0
WINDOW 0 -22 -1 Left 1
SYMATTR InstName U11
SYMATTR Value2 Avol=200K GBW=10Meg Slew=9Meg
SYMATTR SpiceLine Ilimit=30m Rail=0 Vos=0
SYMBOL OpAmps\\UniversalOpAmp2 -1680 144 R0
WINDOW 0 -22 -1 Left 1
SYMATTR InstName U12
SYMATTR Value2 Avol=200K GBW=10Meg Slew=9Meg
SYMATTR SpiceLine Ilimit=30m Rail=0 Vos=0
SYMBOL res -1600 -16 R90
WINDOW 0 0 56 VBottom 1
WINDOW 3 32 56 VTop 2
SYMATTR InstName R33
SYMATTR Value 3.3K
SYMATTR SpiceLine tol=1
SYMBOL res -1744 112 R90
WINDOW 0 0 56 VBottom 1
WINDOW 3 32 56 VTop 2
SYMATTR InstName R27
SYMATTR Value 3.3K
SYMATTR SpiceLine tol=1
SYMBOL res -1456 128 R90
WINDOW 0 0 56 VBottom 1
WINDOW 3 32 56 VTop 2
SYMATTR InstName R34
SYMATTR Value 10K
SYMATTR SpiceLine tol=1
SYMBOL OpAmps\\UniversalOpAmp2 -960 304 R0
WINDOW 0 -25 -2 Left 1
SYMATTR InstName U13
SYMATTR Value2 Avol=200K GBW=10Meg Slew=9Meg
SYMATTR SpiceLine Ilimit=30m Rail=0 Vos=0
SYMBOL res -960 176 R270
WINDOW 0 32 56 VTop 1
WINDOW 3 71 44 VBottom 1
SYMATTR InstName R31
SYMATTR Value {50000*(ch_a**2)}
SYMATTR SpiceLine tol=1
SYMBOL res -848 176 R270
WINDOW 0 32 56 VTop 1
WINDOW 3 -1 47 VBottom 1
SYMATTR InstName R32
SYMATTR Value {50000*(1-ch_a**2)}
SYMATTR SpiceLine tol=1
SYMBOL res -384 304 R0
WINDOW 0 36 40 Left 1
WINDOW 3 38 58 Left 1
SYMATTR InstName R35
SYMATTR Value {10000*(fade_a)}
SYMATTR SpiceLine tol=1
SYMBOL res -384 432 R0
WINDOW 0 36 40 Left 1
WINDOW 3 39 60 Left 1
SYMATTR InstName R36
SYMATTR Value {10000*(1-fade_a)}
SYMATTR SpiceLine tol=1
SYMBOL res -1040 272 R90
WINDOW 0 0 56 VBottom 1
WINDOW 3 32 56 VTop 2
SYMATTR InstName R37
SYMATTR Value 10K
SYMATTR SpiceLine tol=1
SYMBOL res -1296 144 R270
WINDOW 0 34 56 VTop 1
WINDOW 3 0 56 VBottom 2
SYMATTR InstName R38
SYMATTR Value 10K
SYMATTR SpiceLine tol=1
SYMBOL res -624 144 R90
WINDOW 0 0 56 VBottom 1
WINDOW 3 32 56 VTop 2
SYMATTR InstName R39
SYMATTR Value 500
SYMATTR SpiceLine tol=1
SYMBOL OpAmps\\UniversalOpAmp2 2096 -688 R0
WINDOW 0 -18 0 Left 1
SYMATTR InstName U14
SYMATTR Value2 Avol=200K GBW=10Meg Slew=9Meg
SYMATTR SpiceLine Ilimit=30m Rail=0
SYMBOL OpAmps\\UniversalOpAmp2 2320 -672 R0
WINDOW 0 -15 -1 Left 1
SYMATTR InstName U15
SYMATTR Value2 Avol=200K GBW=10Meg Slew=9Meg
SYMATTR SpiceLine Ilimit=30m Rail=0 Vos=0
SYMBOL OpAmps\\UniversalOpAmp2 2560 -656 R0
WINDOW 0 -20 -1 Left 1
SYMATTR InstName U16
SYMATTR Value2 Avol=200K GBW=10Meg Slew=9Meg
SYMATTR SpiceLine Ilimit=30m Rail=0 Vos=0
SYMBOL OpAmps\\UniversalOpAmp2 2160 -432 R180
WINDOW 0 -24 2 Left 1
SYMATTR InstName U17
SYMATTR Value2 Avol=200K GBW=10Meg Slew=9Meg
SYMATTR SpiceLine Ilimit=30m Rail=0 Vos=0
SYMBOL res 2256 -704 R90
WINDOW 0 5 64 VBottom 1
WINDOW 3 29 63 VTop 2
SYMATTR InstName R41
SYMATTR Value 8.2K
SYMATTR SpiceLine tol=1
SYMBOL res 2464 -688 R90
WINDOW 0 -1 61 VBottom 1
WINDOW 3 33 60 VTop 2
SYMATTR InstName R42
SYMATTR Value 8.2K
SYMATTR SpiceLine tol=1
SYMBOL res 1872 -720 R90
WINDOW 0 -3 57 VBottom 1
WINDOW 3 32 56 VTop 2
SYMATTR InstName R43
SYMATTR Value 10K
SYMATTR SpiceLine tol=1
SYMBOL res 2288 -896 R90
WINDOW 0 0 56 VBottom 1
WINDOW 3 32 56 VTop 2
SYMATTR InstName R44
SYMATTR Value 10K
SYMATTR SpiceLine tol=1
SYMBOL res 2096 -448 R90
WINDOW 0 0 56 VBottom 1
WINDOW 3 35 59 VTop 2
SYMATTR InstName R45
SYMATTR Value 10K
SYMATTR SpiceLine tol=1
SYMBOL res 2064 -800 R90
WINDOW 0 0 56 VBottom 1
WINDOW 3 33 58 VTop 2
SYMATTR InstName R46
SYMATTR Value 10K
SYMATTR SpiceLine tol=1
SYMBOL cap 2304 -800 R90
WINDOW 0 0 32 VBottom 1
WINDOW 3 28 22 VTop 2
SYMATTR InstName C9
SYMATTR Value 100n
SYMBOL cap 2624 -800 R90
WINDOW 0 0 32 VBottom 1
WINDOW 3 31 28 VTop 2
SYMATTR InstName C10
SYMATTR Value 100n
SYMBOL res 2368 -432 R90
WINDOW 0 -2 59 VBottom 1
WINDOW 3 31 54 VTop 2
SYMATTR InstName R47
SYMATTR Value 5K
SYMATTR SpiceLine tol=1
SYMBOL res 2208 -320 R90
WINDOW 0 0 75 VBottom 1
WINDOW 3 32 56 VTop 2
SYMATTR InstName R48
SYMATTR Value 10K
SYMATTR SpiceLine tol=1
SYMBOL voltage 768 -672 R90
WINDOW 0 -51 8 VRight 2
WINDOW 3 -23 8 VRight 2
WINDOW 123 5 8 VRight 2
WINDOW 39 0 0 Left 0
SYMATTR InstName track_b
SYMATTR Value ""
SYMATTR Value2 AC 1
SYMBOL OpAmps\\UniversalOpAmp2 2752 -352 R0
WINDOW 0 -19 -1 Left 1
SYMATTR InstName U18
SYMATTR Value2 Avol=200K GBW=10Meg Slew=9Meg
SYMATTR SpiceLine Ilimit=30m Rail=0
SYMBOL OpAmps\\UniversalOpAmp2 3072 -336 R0
WINDOW 0 -26 -2 Left 1
SYMATTR InstName U19
SYMATTR Value2 Avol=200K GBW=10Meg Slew=9Meg
SYMATTR SpiceLine Ilimit=30m Rail=0 Vos=0
SYMBOL OpAmps\\UniversalOpAmp2 3312 -320 R0
WINDOW 0 -24 -2 Left 1
SYMATTR InstName U20
SYMATTR Value2 Avol=200K GBW=10Meg Slew=9Meg
SYMATTR SpiceLine Ilimit=30m Rail=0 Vos=0
SYMBOL OpAmps\\UniversalOpAmp2 2848 -176 R180
WINDOW 0 -24 1 Left 1
SYMATTR InstName U21
SYMATTR Value2 Avol=200K GBW=10Meg Slew=9Meg
SYMATTR SpiceLine Ilimit=30m Rail=0 Vos=0
SYMBOL res 3008 -368 R90
WINDOW 0 3 63 VBottom 1
WINDOW 3 31 59 VTop 2
SYMATTR InstName R49
SYMATTR Value 3.9K
SYMATTR SpiceLine tol=1
SYMBOL res 3216 -352 R90
WINDOW 0 0 62 VBottom 1
WINDOW 3 27 57 VTop 2
SYMATTR InstName R50
SYMATTR Value 3.9K
SYMATTR SpiceLine tol=1
SYMBOL res 2640 -384 R90
WINDOW 0 -6 56 VBottom 1
WINDOW 3 32 56 VTop 2
SYMATTR InstName R51
SYMATTR Value 10K
SYMATTR SpiceLine tol=1
SYMBOL res 3008 -560 R90
WINDOW 0 0 56 VBottom 1
WINDOW 3 32 56 VTop 2
SYMATTR InstName R52
SYMATTR Value 10K
SYMATTR SpiceLine tol=1
SYMBOL res 2784 -192 R90
WINDOW 0 -5 62 VBottom 1
WINDOW 3 39 63 VTop 2
SYMATTR InstName R53
SYMATTR Value 10K
SYMATTR SpiceLine tol=1
SYMBOL res 2768 -464 R90
WINDOW 0 0 56 VBottom 1
WINDOW 3 30 60 VTop 2
SYMATTR InstName R54
SYMATTR Value 10K
SYMATTR SpiceLine tol=1
SYMBOL cap 3056 -464 R90
WINDOW 0 0 32 VBottom 1
WINDOW 3 30 29 VTop 2
SYMATTR InstName C11
SYMATTR Value 10n
SYMBOL cap 3376 -464 R90
WINDOW 0 0 32 VBottom 1
WINDOW 3 32 32 VTop 2
SYMATTR InstName C12
SYMATTR Value 10n
SYMBOL res 3056 -176 R90
WINDOW 0 0 56 VBottom 1
WINDOW 3 35 55 VTop 2
SYMATTR InstName R55
SYMATTR Value 6K
SYMATTR SpiceLine tol=1
SYMBOL res 2896 -64 R90
WINDOW 0 -3 54 VBottom 1
WINDOW 3 32 56 VTop 2
SYMATTR InstName R56
SYMATTR Value 10K
SYMATTR SpiceLine tol=1
SYMBOL res 992 512 R270
WINDOW 0 32 56 VTop 1
WINDOW 3 68 62 VBottom 1
SYMATTR InstName R61
SYMATTR Value {50000*(1-low_b)}
SYMATTR SpiceLine tol=1
SYMBOL res 1120 512 R270
WINDOW 0 32 56 VTop 1
WINDOW 3 72 67 VBottom 1
SYMATTR InstName R62
SYMATTR Value {50000*low_b}
SYMATTR SpiceLine tol=1
SYMBOL res 992 320 R270
WINDOW 0 32 56 VTop 1
WINDOW 3 75 55 VBottom 1
SYMATTR InstName R63
SYMATTR Value {50000*(1-band_b)}
SYMATTR SpiceLine tol=1
SYMBOL res 1120 320 R270
WINDOW 0 32 56 VTop 1
WINDOW 3 69 70 VBottom 1
SYMATTR InstName R64
SYMATTR Value {50000*band_b}
SYMATTR SpiceLine tol=1
SYMBOL res 832 144 R270
WINDOW 0 32 56 VTop 1
WINDOW 3 67 61 VBottom 1
SYMATTR InstName R65
SYMATTR Value {50000*(1-high_b)}
SYMATTR SpiceLine tol=1
SYMBOL res 960 144 R270
WINDOW 0 33 58 VTop 1
WINDOW 3 68 74 VBottom 1
SYMATTR InstName R66
SYMATTR Value {50000*high_b}
SYMATTR SpiceLine tol=1
SYMBOL res 1536 288 R90
WINDOW 0 0 56 VBottom 1
WINDOW 3 32 56 VTop 2
SYMATTR InstName R67
SYMATTR Value 10K
SYMATTR SpiceLine tol=1
SYMBOL res 1536 480 R90
WINDOW 0 0 56 VBottom 1
WINDOW 3 32 56 VTop 2
SYMATTR InstName R68
SYMATTR Value 10K
SYMATTR SpiceLine tol=1
SYMBOL OpAmps\\UniversalOpAmp2 1744 288 R0
WINDOW 0 -22 -2 Left 1
SYMATTR InstName U24
SYMATTR Value2 Avol=200K GBW=10Meg Slew=9Meg
SYMATTR SpiceLine Ilimit=30m Rail=0 Vos=0
SYMBOL OpAmps\\UniversalOpAmp2 1312 144 R0
WINDOW 0 -22 -1 Left 1
SYMATTR InstName U25
SYMATTR Value2 Avol=200K GBW=10Meg Slew=9Meg
SYMATTR SpiceLine Ilimit=30m Rail=0 Vos=0
SYMBOL res 1392 -16 R90
WINDOW 0 0 56 VBottom 1
WINDOW 3 32 56 VTop 2
SYMATTR InstName R69
SYMATTR Value 3.3K
SYMATTR SpiceLine tol=1
SYMBOL res 1248 112 R90
WINDOW 0 0 56 VBottom 1
WINDOW 3 32 56 VTop 2
SYMATTR InstName R70
SYMATTR Value 3.3K
SYMATTR SpiceLine tol=1
SYMBOL res 1536 128 R90
WINDOW 0 0 56 VBottom 1
WINDOW 3 32 56 VTop 2
SYMATTR InstName R71
SYMATTR Value 10K
SYMATTR SpiceLine tol=1
SYMBOL OpAmps\\UniversalOpAmp2 2032 304 R0
WINDOW 0 -25 -2 Left 1
SYMATTR InstName U26
SYMATTR Value2 Avol=200K GBW=10Meg Slew=9Meg
SYMATTR SpiceLine Ilimit=30m Rail=0 Vos=0
SYMBOL res 2032 176 R270
WINDOW 0 32 56 VTop 1
WINDOW 3 71 44 VBottom 1
SYMATTR InstName R72
SYMATTR Value {50000*(ch_b**2)}
SYMATTR SpiceLine tol=1
SYMBOL res 2144 176 R270
WINDOW 0 32 56 VTop 1
WINDOW 3 -1 47 VBottom 1
SYMATTR InstName R73
SYMATTR Value {50000*(1-ch_b**2)}
SYMATTR SpiceLine tol=1
SYMBOL res 2608 304 R0
WINDOW 0 36 40 Left 1
WINDOW 3 38 58 Left 1
SYMATTR InstName R74
SYMATTR Value {10000*(fade_b)}
SYMATTR SpiceLine tol=1
SYMBOL res 2608 432 R0
WINDOW 0 36 40 Left 1
WINDOW 3 39 60 Left 1
SYMATTR InstName R75
SYMATTR Value {10000*(1-fade_b)}
SYMATTR SpiceLine tol=1
SYMBOL res 1952 272 R90
WINDOW 0 0 56 VBottom 1
WINDOW 3 32 56 VTop 2
SYMATTR InstName R77
SYMATTR Value 10K
SYMATTR SpiceLine tol=1
SYMBOL res 1696 144 R270
WINDOW 0 34 56 VTop 1
WINDOW 3 0 56 VBottom 2
SYMATTR InstName R78
SYMATTR Value 10K
SYMATTR SpiceLine tol=1
SYMBOL res 2368 144 R90
WINDOW 0 0 56 VBottom 1
WINDOW 3 32 56 VTop 2
SYMATTR InstName R79
SYMATTR Value 500
SYMATTR SpiceLine tol=1
SYMBOL res -288 2576 R0
WINDOW 0 36 40 Left 1
WINDOW 3 38 58 Left 1
SYMATTR InstName R83
SYMATTR Value {10000*(cross)}
SYMATTR SpiceLine tol=1
SYMBOL res -288 2704 R0
WINDOW 0 36 40 Left 1
WINDOW 3 39 60 Left 1
SYMATTR InstName R84
SYMATTR Value {10000*(1-cross)}
SYMATTR SpiceLine tol=1
SYMBOL res -288 2976 R0
WINDOW 0 36 40 Left 1
WINDOW 3 38 58 Left 1
SYMATTR InstName R85
SYMATTR Value {10000*(cross)}
SYMATTR SpiceLine tol=1
SYMBOL res -288 3104 R0
WINDOW 0 36 40 Left 1
WINDOW 3 39 60 Left 1
SYMATTR InstName R86
SYMATTR Value {10000*(1-cross)}
SYMATTR SpiceLine tol=1
SYMBOL res -64 3088 R90
WINDOW 0 0 56 VBottom 1
WINDOW 3 32 56 VTop 2
SYMATTR InstName R87
SYMATTR Value 10K
SYMATTR SpiceLine tol=1
SYMBOL res -80 2688 R90
WINDOW 0 0 56 VBottom 1
WINDOW 3 32 56 VTop 2
SYMATTR InstName R88
SYMATTR Value 10K
SYMATTR SpiceLine tol=1
SYMBOL OpAmps\\UniversalOpAmp2 304 2896 R0
WINDOW 0 -22 -2 Left 1
SYMATTR InstName U27
SYMATTR Value2 Avol=200K GBW=10Meg Slew=9Meg
SYMATTR SpiceLine Ilimit=30m Rail=0 Vos=0
SYMBOL res 256 2752 R270
WINDOW 0 34 56 VTop 1
WINDOW 3 0 56 VBottom 2
SYMATTR InstName R93
SYMATTR Value 10K
SYMATTR SpiceLine tol=1
SYMBOL OpAmps\\UniversalOpAmp2 624 2912 R0
WINDOW 0 -22 -2 Left 1
SYMATTR InstName U28
SYMATTR Value2 Avol=200K GBW=10Meg Slew=9Meg
SYMATTR SpiceLine Ilimit=30m Rail=0 Vos=0
SYMBOL res 768 2928 R270
WINDOW 0 32 56 VTop 1
WINDOW 3 75 55 VBottom 1
SYMATTR InstName R89
SYMATTR Value {50000*(master)}
SYMATTR SpiceLine tol=1
SYMBOL res 896 2928 R270
WINDOW 0 32 56 VTop 1
WINDOW 3 -10 70 VBottom 1
SYMATTR InstName R90
SYMATTR Value {50000*(1-master)}
SYMATTR SpiceLine tol=1
SYMBOL res 1136 2944 R0
WINDOW 0 36 40 Left 1
WINDOW 3 36 62 Left 2
SYMATTR InstName R92
SYMATTR Value 100k
SYMATTR SpiceLine tol=1
SYMBOL OpAmps\\UniversalOpAmp2 1248 2896 R0
WINDOW 0 -22 -2 Left 1
SYMATTR InstName U29
SYMATTR Value2 Avol=200K GBW=10Meg Slew=9Meg
SYMATTR SpiceLine Ilimit=30m Rail=0 Vos=0
SYMBOL res 1472 2912 R270
WINDOW 0 34 56 VTop 1
WINDOW 3 0 56 VBottom 2
SYMATTR InstName R94
SYMATTR Value 47
SYMATTR SpiceLine tol=1
SYMBOL res 416 2912 R270
WINDOW 0 34 56 VTop 1
WINDOW 3 0 56 VBottom 2
SYMATTR InstName R95
SYMATTR Value 3.3K
SYMATTR SpiceLine tol=1
SYMBOL res 576 2768 R270
WINDOW 0 34 56 VTop 1
WINDOW 3 0 56 VBottom 2
SYMATTR InstName R96
SYMATTR Value 10K
SYMATTR SpiceLine tol=1
SYMBOL res -1728 656 R0
WINDOW 0 36 40 Left 1
WINDOW 3 38 58 Left 1
SYMATTR InstName R99
SYMATTR Value {10000*(cfx_a)}
SYMATTR SpiceLine tol=1
SYMBOL res -1728 784 R0
WINDOW 0 36 40 Left 1
WINDOW 3 39 60 Left 1
SYMATTR InstName R100
SYMATTR Value {10000*(1-cfx_a)}
SYMATTR SpiceLine tol=1
SYMBOL res -1728 1056 R0
WINDOW 0 36 40 Left 1
WINDOW 3 38 58 Left 1
SYMATTR InstName R101
SYMATTR Value {10000*(cfx_a)}
SYMATTR SpiceLine tol=1
SYMBOL res -1728 1184 R0
WINDOW 0 36 40 Left 1
WINDOW 3 39 60 Left 1
SYMATTR InstName R102
SYMATTR Value {10000*(1-cfx_a)}
SYMATTR SpiceLine tol=1
SYMBOL res -1456 1168 R90
WINDOW 0 0 56 VBottom 1
WINDOW 3 32 56 VTop 2
SYMATTR InstName R103
SYMATTR Value 10K
SYMATTR SpiceLine tol=1
SYMBOL res -1456 768 R90
WINDOW 0 0 56 VBottom 1
WINDOW 3 32 56 VTop 2
SYMATTR InstName R104
SYMATTR Value 10K
SYMATTR SpiceLine tol=1
SYMBOL res 1264 736 R0
WINDOW 0 36 40 Left 1
WINDOW 3 38 58 Left 1
SYMATTR InstName R107
SYMATTR Value {10000*(cfx_b)}
SYMATTR SpiceLine tol=1
SYMBOL res 1264 864 R0
WINDOW 0 36 40 Left 1
WINDOW 3 39 60 Left 1
SYMATTR InstName R108
SYMATTR Value {10000*(1-cfx_b)}
SYMATTR SpiceLine tol=1
SYMBOL res 1264 1136 R0
WINDOW 0 36 40 Left 1
WINDOW 3 38 58 Left 1
SYMATTR InstName R109
SYMATTR Value {10000*(cfx_b)}
SYMATTR SpiceLine tol=1
SYMBOL res 1264 1264 R0
WINDOW 0 36 40 Left 1
WINDOW 3 39 60 Left 1
SYMATTR InstName R110
SYMATTR Value {10000*(1-cfx_b)}
SYMATTR SpiceLine tol=1
SYMBOL res 1536 1248 R90
WINDOW 0 0 56 VBottom 1
WINDOW 3 32 56 VTop 2
SYMATTR InstName R111
SYMATTR Value 10K
SYMATTR SpiceLine tol=1
SYMBOL res 1536 848 R90
WINDOW 0 0 56 VBottom 1
WINDOW 3 32 56 VTop 2
SYMATTR InstName R112
SYMATTR Value 10K
SYMATTR SpiceLine tol=1
SYMBOL res -832 464 R180
WINDOW 0 36 76 Left 1
WINDOW 3 41 54 Left 2
SYMATTR InstName R30
SYMATTR Value 390
SYMATTR SpiceLine tol=1
SYMBOL diode -736 512 R270
WINDOW 0 32 32 VTop 2
WINDOW 3 0 32 VBottom 2
SYMATTR InstName D3
SYMBOL res 2160 448 R180
WINDOW 0 36 76 Left 1
WINDOW 3 41 54 Left 2
SYMATTR InstName R76
SYMATTR Value 390
SYMATTR SpiceLine tol=1
SYMBOL diode 2256 496 R270
WINDOW 0 32 32 VTop 2
WINDOW 3 0 32 VBottom 2
SYMATTR InstName D6
SYMBOL res -336 2112 R90
WINDOW 0 0 56 VBottom 1
WINDOW 3 32 56 VTop 2
SYMATTR InstName R91
SYMATTR Value 10K
SYMATTR SpiceLine tol=1
SYMBOL res -336 2320 R90
WINDOW 0 0 56 VBottom 1
WINDOW 3 32 56 VTop 2
SYMATTR InstName R113
SYMATTR Value 10K
SYMATTR SpiceLine tol=1
SYMBOL OpAmps\\UniversalOpAmp2 -208 2240 R0
WINDOW 0 -22 -1 Left 1
SYMATTR InstName U30
SYMATTR Value2 Avol=200K GBW=10Meg Slew=9Meg
SYMATTR SpiceLine Ilimit=30m Rail=0 Vos=0
SYMBOL res -272 2112 R270
WINDOW 0 34 56 VTop 1
WINDOW 3 0 56 VBottom 2
SYMATTR InstName R114
SYMATTR Value 7.8K
SYMATTR SpiceLine tol=1
SYMBOL res 64 2128 R270
WINDOW 0 32 56 VTop 1
WINDOW 3 71 44 VBottom 1
SYMATTR InstName R115
SYMATTR Value {50000*(pfl**2)}
SYMATTR SpiceLine tol=1
SYMBOL res 176 2128 R270
WINDOW 0 32 56 VTop 1
WINDOW 3 -1 47 VBottom 1
SYMATTR InstName R116
SYMATTR Value {50000*(1-pfl**2)}
SYMATTR SpiceLine tol=1
SYMBOL res -16 2224 R90
WINDOW 0 0 56 VBottom 1
WINDOW 3 32 56 VTop 2
SYMATTR InstName R117
SYMATTR Value 10K
SYMATTR SpiceLine tol=1
SYMBOL res 400 2096 R90
WINDOW 0 0 56 VBottom 1
WINDOW 3 32 56 VTop 2
SYMATTR InstName R122
SYMATTR Value 500
SYMATTR SpiceLine tol=1
SYMBOL OpAmps\\UniversalOpAmp2 64 2256 R0
WINDOW 0 -22 -1 Left 1
SYMATTR InstName U31
SYMATTR Value2 Avol=200K GBW=10Meg Slew=9Meg
SYMATTR SpiceLine Ilimit=30m Rail=0 Vos=0
SYMBOL res 368 2240 R90
WINDOW 0 0 56 VBottom 2
WINDOW 3 32 56 VTop 2
SYMATTR InstName R118
SYMATTR Value 150
SYMBOL OpAmps\\UniversalOpAmp2 1120 -688 R0
WINDOW 0 -20 -1 Left 1
SYMATTR InstName U32
SYMATTR Value2 Avol=200K GBW=10Meg Slew=9Meg
SYMATTR SpiceLine Ilimit=30m Rail=0
SYMBOL res 1104 -560 R90
WINDOW 0 -6 53 VBottom 1
WINDOW 3 36 57 VTop 2
SYMATTR InstName R40
SYMATTR Value 100K
SYMATTR SpiceLine tol=1
SYMBOL res 944 -832 R0
WINDOW 0 -45 29 Left 1
WINDOW 3 -53 52 Left 2
SYMATTR InstName R80
SYMATTR Value 100K
SYMATTR SpiceLine tol=1
SYMBOL cap 1056 -688 R90
WINDOW 0 -11 32 VBottom 1
WINDOW 3 32 32 VTop 2
SYMATTR InstName C17
SYMATTR Value 100n
SYMBOL cap 912 -688 R90
WINDOW 0 -10 32 VBottom 1
WINDOW 3 32 32 VTop 2
SYMATTR InstName C18
SYMATTR Value 100n
SYMBOL OpAmps\\UniversalOpAmp2 1520 -704 R0
WINDOW 0 -27 0 Left 1
SYMATTR InstName U33
SYMATTR Value2 Avol=200K GBW=10Meg Slew=9Meg
SYMATTR SpiceLine Ilimit=30m Rail=0
SYMBOL res 1504 -576 R90
WINDOW 0 0 53 VBottom 1
WINDOW 3 41 55 VTop 2
SYMATTR InstName R81
SYMATTR Value 100K
SYMATTR SpiceLine tol=1
SYMBOL res 1344 -848 R0
WINDOW 0 -44 36 Left 1
WINDOW 3 -51 59 Left 2
SYMATTR InstName R82
SYMATTR Value 100K
SYMATTR SpiceLine tol=1
SYMBOL cap 1456 -704 R90
WINDOW 0 -7 32 VBottom 1
WINDOW 3 32 32 VTop 2
SYMATTR InstName C19
SYMATTR Value 100n
SYMBOL cap 1312 -704 R90
WINDOW 0 -8 32 VBottom 1
WINDOW 3 32 32 VTop 2
SYMATTR InstName C20
SYMATTR Value 100n
TEXT -136 1992 Left 5 ;PFL
TEXT -1256 -1080 Left 6 ;TRACK A
TEXT 1712 -1120 Left 6 ;TRACK B
TEXT 304 1760 Left 6 ;SUMMING

The netlist it stands for:
* Full_Mixer.asc
X§U1 0 N001 +15V -15V N003 level2 Avol=200K GBW=10Meg Slew=9Meg Ilimit=30m Rail=0 En=0 Enk=0 In=0 Ink=0 Rin=500Meg  ; pins In+ In- V+ V- OUT
X§U2 0 N015 +15V -15V N004 level2 Avol=200K GBW=10Meg Slew=9Meg Ilimit=30m Rail=0 Vos=0 En=0 Enk=0 In=0 Ink=0 Rin=500Meg  ; pins In+ In- V+ V- OUT
X§U3 0 N005 +15V -15V low_pass_a level2 Avol=200K GBW=10Meg Slew=9Meg Ilimit=30m Rail=0 Vos=0 En=0 Enk=0 In=0 Ink=0 Rin=500Meg  ; pins In+ In- V+ V- OUT
X§U4 0 N033 +15V -15V N031 level2 Avol=200K GBW=10Meg Slew=9Meg Ilimit=30m Rail=0 Vos=0 En=0 Enk=0 In=0 Ink=0 Rin=500Meg  ; pins In+ In- V+ V- OUT
V§pos_rail +15V 0 15
R1 N015 N003 8.2K tol=1
R2 N005 N004 8.2K tol=1
R3 N001 N009 10K tol=1
R4 low_pass_a N001 10K tol=1
R5 N031 N001 10K tol=1
R7 N003 N001 10K tol=1
C1 N004 N015 100n
C2 low_pass_a N005 100n
R6 N004 N033 5K tol=1
R8 N033 N031 10K tol=1
V§track_a N019 0 AC 1
V§neg_rail 0 -15V 15
X§U5 0 N025 +15V -15V high_pass_a level2 Avol=200K GBW=10Meg Slew=9Meg Ilimit=30m Rail=0 En=0 Enk=0 In=0 Ink=0 Rin=500Meg  ; pins In+ In- V+ V- OUT
X§U6 0 N035 +15V -15V N027 level2 Avol=200K GBW=10Meg Slew=9Meg Ilimit=30m Rail=0 Vos=0 En=0 Enk=0 In=0 Ink=0 Rin=500Meg  ; pins In+ In- V+ V- OUT
X§U7 0 N028 +15V -15V band_pass_a level2 Avol=200K GBW=10Meg Slew=9Meg Ilimit=30m Rail=0 Vos=0 En=0 Enk=0 In=0 Ink=0 Rin=500Meg  ; pins In+ In- V+ V- OUT
X§U8 0 N039 +15V -15V N037 level2 Avol=200K GBW=10Meg Slew=9Meg Ilimit=30m Rail=0 Vos=0 En=0 Enk=0 In=0 Ink=0 Rin=500Meg  ; pins In+ In- V+ V- OUT
R9 N035 high_pass_a 3.9K tol=1
R10 N028 N027 3.9K tol=1
R11 N025 N003 10K tol=1
R12 band_pass_a N025 10K tol=1
R13 N037 N025 10K tol=1
R14 high_pass_a N025 10K tol=1
C3 N027 N035 10n
C4 band_pass_a N028 10n
R15 N027 N039 6K tol=1
R16 N039 N037 10K tol=1
X§U9 N021 N011 +15V -15V N011 level2 Avol=200K GBW=10Meg Slew=9Meg Ilimit=30m Rail=0 En=0 Enk=0 In=0 Ink=0 Rin=500Meg  ; pins In+ In- V+ V- OUT
R17 N011 N020 28K tol=1
R18 0 N020 28K tol=1
C5 N021 N020 470n
C6 N020 N019 470n
X§U10 N014 N009 +15V -15V N009 level2 Avol=200K GBW=10Meg Slew=9Meg Ilimit=30m Rail=0 En=0 Enk=0 In=0 Ink=0 Rin=500Meg  ; pins In+ In- V+ V- OUT
R19 N009 N013 28K tol=1
R20 0 N013 28K tol=1
C7 N014 N013 470n
C8 N013 N011 470n
R21 low_pass_a low_pass_a {50000*(1-low_a)} tol=1
R22 low_pass_a 0 {50000*low_a} tol=1
R23 band_pass_a band_pass_a {50000*(1-band_a)} tol=1
R24 band_pass_a 0 {50000*band_a} tol=1
R25 high_pass_a high_pass_a {50000*(1-high_a)} tol=1
R26 high_pass_a 0 {50000*high_a} tol=1
R28 N043 band_pass_a 10K tol=1
R29 N043 low_pass_a 10K tol=1
X§U11 0 N043 +15V -15V sum_out_a level2 Avol=200K GBW=10Meg Slew=9Meg Ilimit=30m Rail=0 Vos=0 En=0 Enk=0 In=0 Ink=0 Rin=500Meg  ; pins In+ In- V+ V- OUT
X§U12 0 N041 +15V -15V N045 level2 Avol=200K GBW=10Meg Slew=9Meg Ilimit=30m Rail=0 Vos=0 En=0 Enk=0 In=0 Ink=0 Rin=500Meg  ; pins In+ In- V+ V- OUT
R33 N045 N041 3.3K tol=1
R27 N041 high_pass_a 3.3K tol=1
R34 N043 N045 10K tol=1
X§U13 0 N047 +15V -15V pfl_a level2 Avol=200K GBW=10Meg Slew=9Meg Ilimit=30m Rail=0 Vos=0 En=0 Enk=0 In=0 Ink=0 Rin=500Meg  ; pins In+ In- V+ V- OUT
R31 N047 pfl_a {50000*(ch_a**2)} tol=1
R32 pfl_a N048 {50000*(1-ch_a**2)} tol=1
R35 pfl_a a_out {10000*(fade_a)} tol=1
R36 a_out 0 {10000*(1-fade_a)} tol=1
R37 N047 sum_out_a 10K tol=1
R38 N043 sum_out_a 10K tol=1
R39 0 N048 500 tol=1
X§U14 0 N002 +15V -15V N006 level2 Avol=200K GBW=10Meg Slew=9Meg Ilimit=30m Rail=0 En=0 Enk=0 In=0 Ink=0 Rin=500Meg  ; pins In+ In- V+ V- OUT
X§U15 0 N018 +15V -15V N007 level2 Avol=200K GBW=10Meg Slew=9Meg Ilimit=30m Rail=0 Vos=0 En=0 Enk=0 In=0 Ink=0 Rin=500Meg  ; pins In+ In- V+ V- OUT
X§U16 0 N008 +15V -15V low_pass_b level2 Avol=200K GBW=10Meg Slew=9Meg Ilimit=30m Rail=0 Vos=0 En=0 Enk=0 In=0 Ink=0 Rin=500Meg  ; pins In+ In- V+ V- OUT
X§U17 0 N034 +15V -15V N032 level2 Avol=200K GBW=10Meg Slew=9Meg Ilimit=30m Rail=0 Vos=0 En=0 Enk=0 In=0 Ink=0 Rin=500Meg  ; pins In+ In- V+ V- OUT
R41 N018 N006 8.2K tol=1
R42 N008 N007 8.2K tol=1
R43 N002 N010 10K tol=1
R44 low_pass_b N002 10K tol=1
R45 N032 N002 10K tol=1
R46 N006 N002 10K tol=1
C9 N007 N018 100n
C10 low_pass_b N008 100n
R47 N007 N034 5K tol=1
R48 N034 N032 10K tol=1
V§track_b N022 0 AC 1
X§U18 0 N026 +15V -15V high_pass_b level2 Avol=200K GBW=10Meg Slew=9Meg Ilimit=30m Rail=0 En=0 Enk=0 In=0 Ink=0 Rin=500Meg  ; pins In+ In- V+ V- OUT
X§U19 0 N036 +15V -15V N029 level2 Avol=200K GBW=10Meg Slew=9Meg Ilimit=30m Rail=0 Vos=0 En=0 Enk=0 In=0 Ink=0 Rin=500Meg  ; pins In+ In- V+ V- OUT
X§U20 0 N030 +15V -15V band_pass_b level2 Avol=200K GBW=10Meg Slew=9Meg Ilimit=30m Rail=0 Vos=0 En=0 Enk=0 In=0 Ink=0 Rin=500Meg  ; pins In+ In- V+ V- OUT
X§U21 0 N040 +15V -15V N038 level2 Avol=200K GBW=10Meg Slew=9Meg Ilimit=30m Rail=0 Vos=0 En=0 Enk=0 In=0 Ink=0 Rin=500Meg  ; pins In+ In- V+ V- OUT
R49 N036 high_pass_b 3.9K tol=1
R50 N030 N029 3.9K tol=1
R51 N026 N006 10K tol=1
R52 band_pass_b N026 10K tol=1
R53 N038 N026 10K tol=1
R54 high_pass_b N026 10K tol=1
C11 N029 N036 10n
C12 band_pass_b N030 10n
R55 N029 N040 6K tol=1
R56 N040 N038 10K tol=1
R61 low_pass_b low_pass_b {50000*(1-low_b)} tol=1
R62 low_pass_b 0 {50000*low_b} tol=1
R63 band_pass_b band_pass_b {50000*(1-band_b)} tol=1
R64 band_pass_b 0 {50000*band_b} tol=1
R65 high_pass_b high_pass_b {50000*(1-high_b)} tol=1
R66 high_pass_b 0 {50000*high_b} tol=1
R67 N044 band_pass_b 10K tol=1
R68 N044 low_pass_b 10K tol=1
X§U24 0 N044 +15V -15V sum_out_b level2 Avol=200K GBW=10Meg Slew=9Meg Ilimit=30m Rail=0 Vos=0 En=0 Enk=0 In=0 Ink=0 Rin=500Meg  ; pins In+ In- V+ V- OUT
X§U25 0 N042 +15V -15V N046 level2 Avol=200K GBW=10Meg Slew=9Meg Ilimit=30m Rail=0 Vos=0 En=0 Enk=0 In=0 Ink=0 Rin=500Meg  ; pins In+ In- V+ V- OUT
R69 N046 N042 3.3K tol=1
R70 N042 high_pass_b 3.3K tol=1
R71 N044 N046 10K tol=1
X§U26 0 N049 +15V -15V pfl_b level2 Avol=200K GBW=10Meg Slew=9Meg Ilimit=30m Rail=0 Vos=0 En=0 Enk=0 In=0 Ink=0 Rin=500Meg  ; pins In+ In- V+ V- OUT
R72 N049 pfl_b {50000*(ch_b**2)} tol=1
R73 pfl_b N050 {50000*(1-ch_b**2)} tol=1
R74 pfl_b b_out {10000*(fade_b)} tol=1
R75 b_out 0 {10000*(1-fade_b)} tol=1
R77 N049 sum_out_b 10K tol=1
R78 N044 sum_out_b 10K tol=1
R79 0 N050 500 tol=1
R83 a_out N064 {10000*(cross)} tol=1
R84 N064 0 {10000*(1-cross)} tol=1
R85 0 N071 {10000*(cross)} tol=1
R86 N071 b_out {10000*(1-cross)} tol=1
R87 N065 N071 10K tol=1
R88 N065 N064 10K tol=1
X§U27 0 N065 +15V -15V master_out level2 Avol=200K GBW=10Meg Slew=9Meg Ilimit=30m Rail=0 Vos=0 En=0 Enk=0 In=0 Ink=0 Rin=500Meg  ; pins In+ In- V+ V- OUT
R93 N065 master_out 10K tol=1
X§U28 0 N066 +15V -15V N067 level2 Avol=200K GBW=10Meg Slew=9Meg Ilimit=30m Rail=0 Vos=0 En=0 Enk=0 In=0 Ink=0 Rin=500Meg  ; pins In+ In- V+ V- OUT
R89 N067 N068 {50000*(master)} tol=1
R90 N068 0 {50000*(1-master)} tol=1
R92 N068 0 100k tol=1
X§U29 N068 N069 +15V -15V N069 level2 Avol=200K GBW=10Meg Slew=9Meg Ilimit=30m Rail=0 Vos=0 En=0 Enk=0 In=0 Ink=0 Rin=500Meg  ; pins In+ In- V+ V- OUT
R94 N069 N070 47 tol=1
R95 master_out N066 3.3K tol=1
R96 N066 N067 10K tol=1
R99 low_pass_a N053 {10000*(cfx_a)} tol=1
R100 N053 0 {10000*(1-cfx_a)} tol=1
R101 0 N055 {10000*(cfx_a)} tol=1
R102 N055 high_pass_a {10000*(1-cfx_a)} tol=1
R103 N043 N055 10K tol=1
R104 N043 N053 10K tol=1
R107 low_pass_b N054 {10000*(cfx_b)} tol=1
R108 N054 0 {10000*(1-cfx_b)} tol=1
R109 0 N056 {10000*(cfx_b)} tol=1
R110 N056 high_pass_b {10000*(1-cfx_b)} tol=1
R111 N044 N056 10K tol=1
R112 N044 N054 10K tol=1
R30 N052 pfl_a 390 tol=1
D3 N052 0 D
R76 N051 pfl_b 390 tol=1
D6 N051 0 D
R91 N057 N062 10K tol=1
R113 N057 N063 10K tol=1
X§U30 0 N057 +15V -15V N058 level2 Avol=200K GBW=10Meg Slew=9Meg Ilimit=30m Rail=0 Vos=0 En=0 Enk=0 In=0 Ink=0 Rin=500Meg  ; pins In+ In- V+ V- OUT
R114 N057 N058 7.8K tol=1
R115 N059 N060 {50000*(pfl**2)} tol=1
R116 N060 N061 {50000*(1-pfl**2)} tol=1
R117 N059 N058 10K tol=1
R122 0 N061 500 tol=1
X§U31 0 N059 +15V -15V N060 level2 Avol=200K GBW=10Meg Slew=9Meg Ilimit=30m Rail=0 Vos=0 En=0 Enk=0 In=0 Ink=0 Rin=500Meg  ; pins In+ In- V+ V- OUT
R118 panel_mount_headphone_jack N060 150
X§U32 N024 N012 +15V -15V N012 level2 Avol=200K GBW=10Meg Slew=9Meg Ilimit=30m Rail=0 En=0 Enk=0 In=0 Ink=0 Rin=500Meg  ; pins In+ In- V+ V- OUT
R40 N012 N023 100K tol=1
R80 0 N023 100K tol=1
C17 N024 N023 100n
C18 N023 N022 100n
X§U33 N017 N010 +15V -15V N010 level2 Avol=200K GBW=10Meg Slew=9Meg Ilimit=30m Rail=0 En=0 Enk=0 In=0 Ink=0 Rin=500Meg  ; pins In+ In- V+ V- OUT
R81 N010 N016 100K tol=1
R82 0 N016 100K tol=1
C19 N017 N016 100n
C20 N016 N012 100n
.model D D
.lib standard.dio
* PFL
* TRACK A
* TRACK B
* SUMMING
.lib UniversalOpAmp2.lib
.backanno
.end